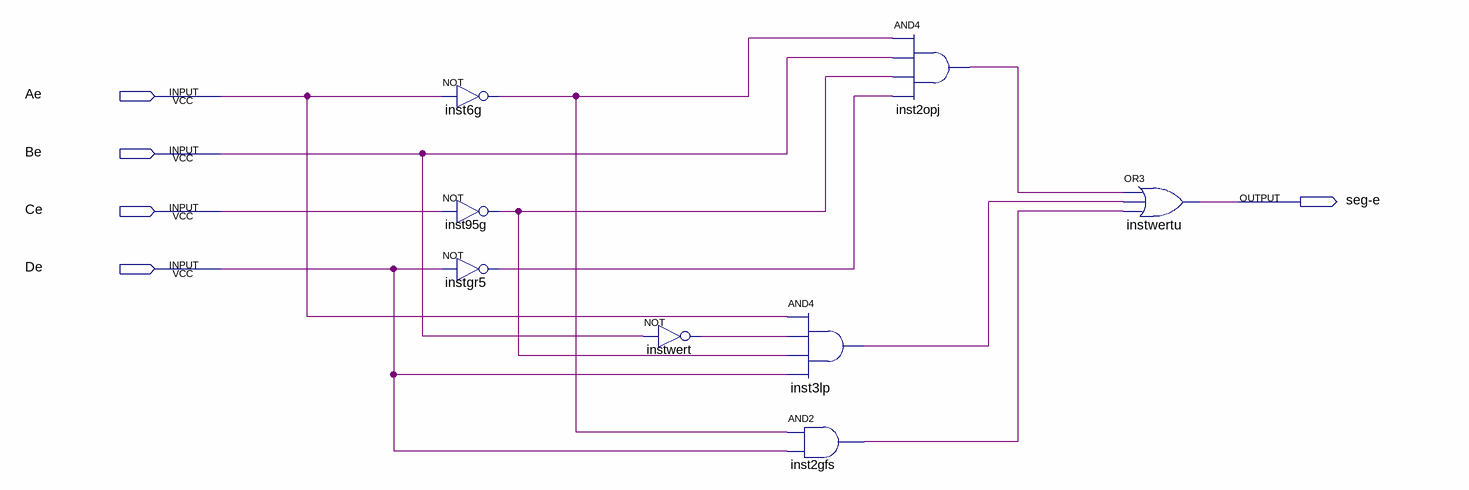
[diagram p0: schematic sheet]
// Quartus schematic segmento_e.bdf as structural Verilog: 8 symbols, 5 pins
module segmento_e (
  input  Ae,
  input  Be,
  input  Ce,
  input  De,
  output \seg-e 
);

  wire inst2gfs_out, inst2opj_out, inst3lp_out, inst6g_out, inst95g_out, instgr5_out, instwert_out;

  not inst6g (inst6g_out, Ae);
  not inst95g (inst95g_out, Ce);
  not instgr5 (instgr5_out, De);
  not instwert (instwert_out, Be);
  and inst3lp (inst3lp_out, Ae, instwert_out, inst95g_out, De);
  and inst2gfs (inst2gfs_out, inst6g_out, De);
  and inst2opj (inst2opj_out, inst6g_out, Be, inst95g_out, instgr5_out);
  or instwertu (\seg-e , inst2opj_out, inst3lp_out, inst2gfs_out);
endmodule
